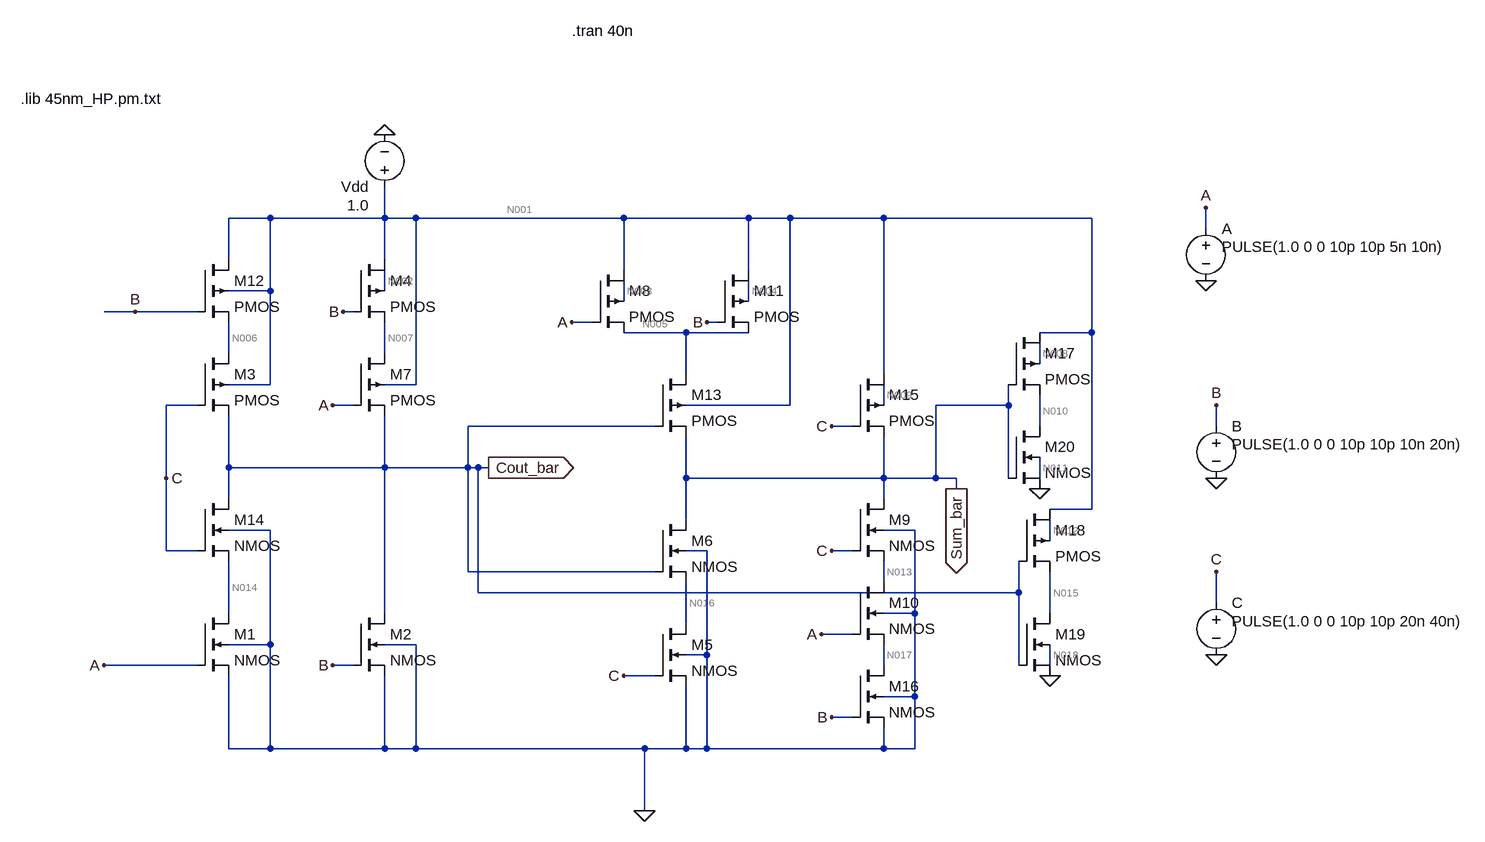
[diagram p0: schematic AMA1_45nm.asc]
AMA1_45nm.asc, the LTspice schematic file:
Version 4
SHEET 1 1044 692
WIRE -816 -240 -880 -240
WIRE -640 -240 -640 -288
WIRE -640 -240 -816 -240
WIRE -592 -240 -640 -240
WIRE -272 -240 -592 -240
WIRE -80 -240 -272 -240
WIRE -16 -240 -80 -240
WIRE 128 -240 -16 -240
WIRE 448 -240 128 -240
WIRE 624 -224 624 -256
WIRE -880 -176 -880 -240
WIRE -640 -176 -640 -240
WIRE -272 -160 -272 -240
WIRE -80 -160 -80 -240
WIRE -816 -128 -816 -240
WIRE -816 -128 -880 -128
WIRE -640 -128 -640 -160
WIRE -272 -112 -272 -144
WIRE -80 -112 -80 -144
WIRE -1024 -96 -1072 -96
WIRE -928 -96 -1024 -96
WIRE -688 -96 -704 -96
WIRE -320 -80 -352 -80
WIRE -128 -80 -144 -80
WIRE -176 -64 -272 -64
WIRE -80 -64 -176 -64
WIRE 448 -64 448 -240
WIRE 448 -64 368 -64
WIRE -880 -32 -880 -80
WIRE -640 -32 -640 -80
WIRE 368 -16 368 -48
WIRE -176 0 -176 -64
WIRE 128 0 128 -240
WIRE -816 16 -816 -128
WIRE -816 16 -880 16
WIRE -592 16 -592 -240
WIRE -592 16 -640 16
WIRE -928 48 -976 48
WIRE -688 48 -720 48
WIRE -16 48 -16 -240
WIRE -16 48 -176 48
WIRE 128 48 128 16
WIRE 320 48 320 16
WIRE 320 48 208 48
WIRE -224 80 -512 80
WIRE 80 80 48 80
WIRE 368 80 368 32
WIRE 640 80 640 48
WIRE -880 144 -880 64
WIRE -640 144 -640 64
WIRE -640 144 -880 144
WIRE -512 144 -512 80
WIRE -512 144 -640 144
WIRE -496 144 -512 144
WIRE -480 144 -496 144
WIRE -976 160 -976 48
WIRE -176 160 -176 96
WIRE 128 160 128 96
WIRE 128 160 -176 160
WIRE 208 160 208 48
WIRE 208 160 128 160
WIRE 240 160 208 160
WIRE 320 160 320 48
WIRE 368 160 368 128
WIRE 240 176 240 160
WIRE -880 192 -880 144
WIRE 128 192 128 160
WIRE 448 208 448 -64
WIRE 448 208 384 208
WIRE -176 224 -176 160
WIRE -816 240 -880 240
WIRE 176 240 128 240
WIRE 384 256 384 224
WIRE -976 272 -976 160
WIRE -928 272 -976 272
WIRE -144 272 -176 272
WIRE 80 272 48 272
WIRE -512 304 -512 144
WIRE -224 304 -512 304
WIRE 128 320 128 288
WIRE -496 336 -496 144
WIRE 336 336 336 288
WIRE 336 336 -496 336
WIRE 640 352 640 304
WIRE -880 368 -880 288
WIRE -640 368 -640 144
WIRE 176 368 176 240
WIRE 176 368 128 368
WIRE 384 368 384 304
WIRE -176 384 -176 320
WIRE 80 400 32 400
WIRE -816 416 -816 240
WIRE -816 416 -880 416
WIRE -592 416 -640 416
WIRE -144 432 -144 272
WIRE -144 432 -176 432
WIRE -928 448 -1072 448
WIRE -688 448 -720 448
WIRE 128 448 128 416
WIRE 336 448 336 336
WIRE 384 448 384 416
WIRE -224 464 -272 464
WIRE 176 496 176 368
WIRE 176 496 128 496
WIRE 80 528 48 528
WIRE -880 576 -880 464
WIRE -816 576 -816 416
WIRE -816 576 -880 576
WIRE -640 576 -640 464
WIRE -640 576 -816 576
WIRE -592 576 -592 416
WIRE -592 576 -640 576
WIRE -240 576 -592 576
WIRE -176 576 -176 480
WIRE -176 576 -240 576
WIRE -144 576 -144 432
WIRE -144 576 -176 576
WIRE 128 576 128 544
WIRE 128 576 -144 576
WIRE 176 576 176 496
WIRE 176 576 128 576
WIRE -240 672 -240 576
FLAG -240 672 0
FLAG -480 144 Cout_bar
IOPIN -480 144 Out
FLAG 240 176 Sum_bar
IOPIN 240 176 Out
FLAG 624 -144 0
FLAG 640 160 0
FLAG 640 432 0
FLAG 624 -256 A
FLAG 640 48 B
FLAG 640 304 C
FLAG -640 -368 0
FLAG -1024 -96 B
FLAG -704 -96 B
FLAG -720 448 B
FLAG -144 -80 B
FLAG 48 528 B
FLAG -1072 448 A
FLAG -720 48 A
FLAG 32 400 A
FLAG -352 -80 A
FLAG -976 160 C
FLAG 48 80 C
FLAG 48 272 C
FLAG -272 464 C
FLAG 384 464 0
FLAG 368 176 0
SYMBOL pmos4 -928 -176 R0
SYMATTR InstName M12
SYMATTR Value2 l=45n w=180n
SYMBOL voltage 624 -240 R0
WINDOW 3 24 44 Left 2
WINDOW 123 0 0 Left 0
WINDOW 39 0 0 Left 0
SYMATTR Value PULSE(1.0 0 0 10p 10p 5n 10n)
SYMATTR InstName A
SYMBOL voltage 640 64 R0
WINDOW 3 24 44 Left 2
WINDOW 123 0 0 Left 0
WINDOW 39 0 0 Left 0
SYMATTR Value PULSE(1.0 0 0 10p 10p 10n 20n)
SYMATTR InstName B
SYMBOL voltage 640 336 R0
WINDOW 3 24 44 Left 2
WINDOW 123 0 0 Left 0
WINDOW 39 0 0 Left 0
SYMATTR Value PULSE(1.0 0 0 10p 10p 20n 40n)
SYMATTR InstName C
SYMBOL voltage -640 -272 R180
WINDOW 3 24 -12 Left 2
WINDOW 123 0 0 Left 0
WINDOW 39 0 0 Left 0
SYMATTR Value 1.0
SYMATTR InstName Vdd
SYMBOL nmos4 -928 192 R0
SYMATTR InstName M14
SYMATTR Value2 l=45n w=90n
SYMBOL pmos4 -928 -32 R0
SYMATTR InstName M3
SYMATTR Value2 l=45n w=180n
SYMBOL pmos4 -688 -176 R0
SYMATTR InstName M4
SYMATTR Value2 l=45n w=180n
SYMBOL pmos4 -688 -32 R0
SYMATTR InstName M7
SYMATTR Value2 l=45n w=180n
SYMBOL pmos4 -320 -160 R0
SYMATTR InstName M8
SYMATTR Value2 l=45n w=180n
SYMBOL pmos4 -128 -160 R0
SYMATTR InstName M11
SYMATTR Value2 l=45n w=180n
SYMBOL pmos4 -224 0 R0
SYMATTR InstName M13
SYMATTR Value2 l=45n w=180n
SYMBOL pmos4 80 0 R0
SYMATTR InstName M15
SYMATTR Value2 l=45n w=180n
SYMBOL nmos4 -928 368 R0
SYMATTR InstName M1
SYMATTR Value2 l=45n w=90n
SYMBOL nmos4 -688 368 R0
SYMATTR InstName M2
SYMATTR Value2 l=45n w=90n
SYMBOL nmos4 -224 384 R0
SYMATTR InstName M5
SYMATTR Value2 l=45n w=90n
SYMBOL nmos4 -224 224 R0
SYMATTR InstName M6
SYMATTR Value2 l=45n w=90n
SYMBOL nmos4 80 192 R0
SYMATTR InstName M9
SYMATTR Value2 l=45n w=90n
SYMBOL nmos4 80 320 R0
SYMATTR InstName M10
SYMATTR Value2 l=45n w=90n
SYMBOL nmos4 80 448 R0
SYMATTR InstName M16
SYMATTR Value2 l=45n w=90n
SYMBOL pmos4 320 -64 R0
SYMATTR InstName M17
SYMATTR Value2 l=45n w=180n
SYMBOL pmos4 336 208 R0
SYMATTR InstName M18
SYMATTR Value2 l=45n w=180n
SYMBOL nmos4 336 368 R0
SYMATTR InstName M19
SYMATTR Value2 l=45n w=90n
SYMBOL nmos4 320 80 R0
SYMATTR InstName M20
SYMATTR Value2 l=45n w=90n
TEXT -1200 -424 Left 2 !.lib 45nm_HP.pm.txt
TEXT -352 -528 Left 2 !.tran 40n

The netlist it stands for:
* AMA1_45nm.asc
M12 N001 B N006 N001 PMOS l=45n w=180n
V§A A 0 PULSE(1.0 0 0 10p 10p 5n 10n)
V§B B 0 PULSE(1.0 0 0 10p 10p 10n 20n)
V§C C 0 PULSE(1.0 0 0 10p 10p 20n 40n)
Vdd N001 0 1.0
M14 Cout_bar C N014 0 NMOS l=45n w=90n
M3 N006 C Cout_bar N001 PMOS l=45n w=180n
M4 N001 B N007 N002 PMOS l=45n w=180n
M7 N007 A Cout_bar N001 PMOS l=45n w=180n
M8 N001 A N005 N003 PMOS l=45n w=180n
M11 N001 B N005 N004 PMOS l=45n w=180n
M13 N005 Cout_bar Sum_bar N001 PMOS l=45n w=180n
M15 N001 C Sum_bar N009 PMOS l=45n w=180n
M1 N014 A 0 0 NMOS l=45n w=90n
M2 Cout_bar B 0 0 NMOS l=45n w=90n
M5 N016 C 0 0 NMOS l=45n w=90n
M6 Sum_bar Cout_bar N016 0 NMOS l=45n w=90n
M9 Sum_bar C N013 0 NMOS l=45n w=90n
M10 N013 A N017 0 NMOS l=45n w=90n
M16 N017 B 0 0 NMOS l=45n w=90n
M17 N001 Sum_bar N010 N008 PMOS l=45n w=180n
M18 N001 Cout_bar N015 N012 PMOS l=45n w=180n
M19 N015 Cout_bar 0 N018 NMOS l=45n w=90n
M20 N010 Sum_bar 0 N011 NMOS l=45n w=90n
.model NMOS NMOS
.model PMOS PMOS
.lib standard.mos
.lib 45nm_HP.pm.txt
.tran 40n
.backanno
.end

* Results of the author's LTspice run, read from the files saved beside the schematic
* Operating Point, zero values left out:
*   V(n001) = 1 V
*   V(b) = 1 V
*   V(n006) = 895.2 mV
*   V(a) = 1 V
*   V(c) = 1 V
*   V(cout_bar) = 1.044 µV
*   V(n014) = 554.1 nV
*   V(n007) = 911.6 mV
*   V(n002) = 887.9 mV
*   V(n005) = 273.2 mV
*   V(n003) = 873 mV
*   V(n004) = 873 mV
*   V(sum_bar) = 26.8 µV
*   V(n009) = 868.5 mV
*   V(n016) = 32.37 nV
*   V(n013) = 17.93 µV
*   V(n017) = 8.997 µV
*   V(n010) = 1 V
*   V(n008) = 840.1 mV
*   V(n015) = 1 V
*   V(n012) = 840.1 mV
*   V(n018) = 260.1 mV
*   V(n011) = 260.1 mV
*   Id(M20) = 10.5 nA
*   Ig(M20) = -12.8 pA
*   Is(M20) = -10.48 nA
*   Id(M19) = 10.49 nA
*   Ig(M19) = -12.8 pA
*   Is(M19) = -10.48 nA
*   Id(M16) = 3.379 nA
*   Ig(M16) = 30.97 pA
*   Ib(M16) = -6.651 pA
*   Is(M16) = -3.404 nA
*   Id(M10) = 3.355 nA
*   Ig(M10) = 30.97 pA
*   Ib(M10) = -6.65 pA
*   Is(M10) = -3.379 nA
*   Id(M9) = 3.331 nA
*   Ig(M9) = 30.97 pA
*   Ib(M9) = -6.649 pA
*   Is(M9) = -3.355 nA
*   Ig(M5) = 30.97 pA
*   Ib(M5) = -6.651 pA
*   Is(M5) = -24.36 pA
*   Id(M2) = 381.3 pA
*   Ig(M2) = 30.97 pA
*   Ib(M2) = -6.651 pA
*   Is(M2) = -405.6 pA
*   Id(M1) = 196.7 pA
*   Ig(M1) = 30.97 pA
*   Ib(M1) = -6.651 pA
*   Is(M1) = -221 pA
*   Id(M14) = 172.4 pA
*   Ig(M14) = 30.97 pA
*   Ib(M14) = -6.651 pA
*   Is(M14) = -196.7 pA
*   Id(M18) = 10.75 nA
*   Ig(M18) = -254.6 pA
*   Is(M18) = -10.49 nA
*   Id(M17) = 10.75 nA
*   Ig(M17) = -254.6 pA
*   Is(M17) = -10.5 nA
*   Id(M15) = 1.881 nA
*   Ig(M15) = 124.8 pA
*   Is(M15) = -2.005 nA
*   Id(M13) = 1.057 nA
*   Ib(M13) = 1.739 pA
*   Is(M13) = -1.059 nA
*   Id(M11) = 488.3 pA
*   Ig(M11) = 41.25 pA
*   Is(M11) = -528.7 pA
*   Id(M8) = 488.3 pA
*   Ig(M8) = 41.25 pA
*   Is(M8) = -528.7 pA
*   Id(M7) = 22.05 pA
*   Ig(M7) = 125.2 pA
*   Ib(M7) = 1.098 pA
*   Is(M7) = -148.3 pA
*   Id(M4) = 22.52 pA
*   Is(M4) = -22.05 pA
*   Id(M3) = 11.01 pA
*   Ig(M3) = 125.3 pA
*   Ib(M3) = 1.115 pA
*   Is(M3) = -137.4 pA
*   Id(M12) = 10.36 pA
*   Is(M12) = -11.01 pA
*   I(Vdd) = -24.39 nA
*   I(C) = -343 pA
*   I(B) = -104.2 pA
*   I(A) = -228.4 pA
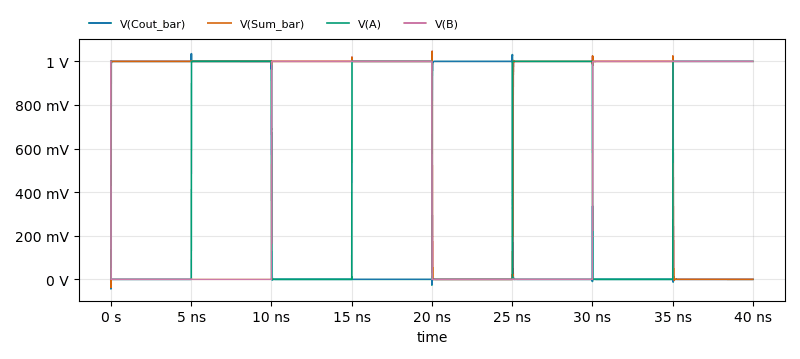
[diagram p1: Transient Analysis of AMA1_45nm.asc, plotted from the saved traces]
* Transient Analysis, 1 run:
*   V(Cout_bar): min -43.65 mV, max 1.035 V, average 375.9 mV, rms 612.7 mV, last 2.009 µV
*   V(Sum_bar): min -37.38 mV, max 1.046 V, average 750.4 mV, rms 865.9 mV, last 37.71 µV
*   V(A): min 0 V, max 1 V, average 499 mV, rms 706.2 mV, last 1 V
*   V(B): min 0 V, max 1 V, average 499.5 mV, rms 706.6 mV, last 1 V